# Altium schematic sheet Sheet1.SchDoc
size A; SheetNumber: 1; SheetTotal: 1
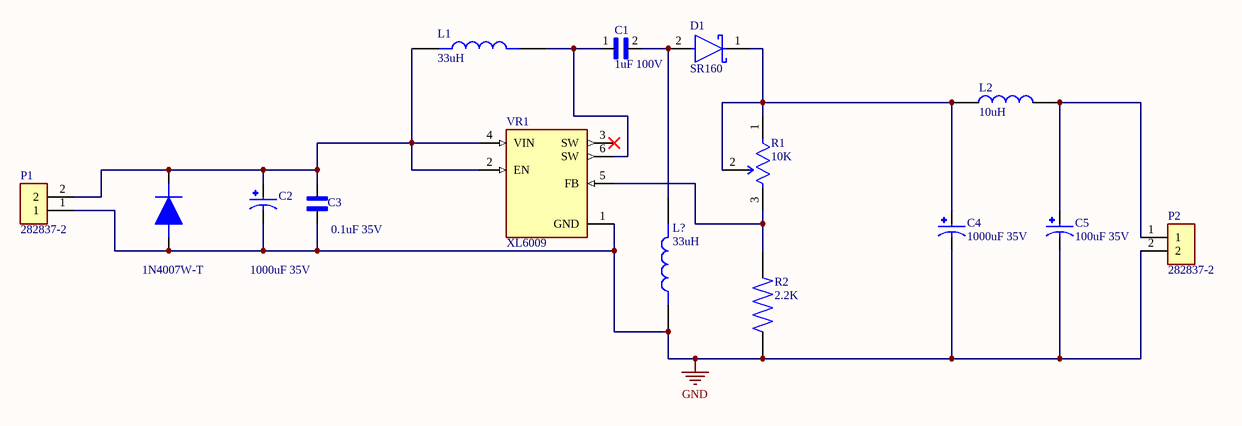
[diagram p0: Sheet1.SchDoc]

## Parts
C1  1uF 100V  [CAPC2012X145N]
C2  1000uF 35V  [CAP_EEVFK1V102V]
C3  0.1uF 35V  [CAPC1608X100N]
C4  1000uF 35V  [CAP_EEVFK1V102V]
C5  100uF 35V  [CAP_EEEFK1V101GL]
D1  SR160  [FP-SOD523-MFG]
L1  33uH  [IND_LQH5BPH330MT0L]
L2  10uH  [INDC1608X95N]
L?  33uH  [IND_LQH5BPH330MT0L]
P1  282837-2  [TE_282837-2]
P2  282837-2  [TE_282837-2]
R1  10K  [FP-TS53YJ-MFG]
R2  2.2K  [RES_ERA8ARW222V]
VR1  XL6009  [DPAK170P1435X465-6N]
  1N4007W-T  [SODFL3818X130N]

## Nets
GND: C2.2 C3.2 C4.2 C5.2 L?.1 P1.1 P2.2 R2.1 VR1.1(GND) .2(A)
NetC1_1: C1.1 L1.2 VR1.6(SW)
NetC1_2: C1.2 D1.2(A) L?.2
NetC2_1: C2.1 C3.1 L1.1 P1.2 VR1.2(EN) VR1.4(VIN) .1(K)
NetC4_1: C4.1 D1.1(C) L2.1 R1.1(a) R1.2(b)
NetC5_1: C5.1 L2.2 P2.1
NetR1_3: R1.3(c) R2.2 VR1.5(FB)

Not connected (* = marked no-connect by the designer): VR1 3(SW)*

## Library data of the parts
C1 = C2012X7S2A105M125AB: 1 ÂµF Â±20% 100V Ceramic Capacitor X7S 0805 (2012 Metric); MF: TDK; Package: 2012 TDK; Purchase-URL: https://pricing.snapeda.com/search/part/C2012X7S2A105M125AB/?ref=eda; Value: *; Availability: In Stock; SnapEDA_Link: https://www.snapeda.com/parts/C2012X7S2A105M125AB/TDK/view-part/?ref=snap; MP: C2012X7S2A105M125AB; Price: None; Check_prices: https://www.snapeda.com/parts/C2012X7S2A105M125AB/TDK/view-part/?ref=eda
C2 C4 = EEVFK1V102V: 1000ÂµF 35V Aluminum Electrolytic Capacitors Radial, Can - SMD 5000 Hrs @ 105Â°C; MP: EEV-FK1V102V; MF: Panasonic; Purchase-URL: https://pricing.snapeda.com/search/part/EEV-FK1V102V/?ref=eda; Price: None; SnapEDA_Link: https://www.snapeda.com/parts/EEV-FK1V102V/Panasonic/view-part/?ref=snap; Check_prices: https://www.snapeda.com/parts/EEV-FK1V102V/Panasonic/view-part/?ref=eda; Package: RADIAL-2 Panasonic; Availability: In Stock; Value: *
C3 = MBJCG168BB7104KTPA18: 0.1uF 35V 10% Multilayer Ceramic Capacitor X7R 0603 (1608 Metric); MF: Taiyo Yuden; SnapEDA_Link: https://www.snapeda.com/parts/MBJCG168BB7104KTPA18/Taiyo+Yuden/view-part/?ref=snap; Package: 1608-2 TAIYO; Value: *; MP: MBJCG168BB7104KTPA18; Check_prices: https://www.snapeda.com/parts/MBJCG168BB7104KTPA18/Taiyo+Yuden/view-part/?ref=eda
C5 = EEEFK1V101GL: CAP ALUM 100UF 20% 35V SMD; MF: Panasonic; SnapEDA_Link: https://www.snapeda.com/parts/EEEFK1V101GL/Panasonic/view-part/?ref=snap; Package: RADIAL-2 Panasonic; Value: *; MP: EEEFK1V101GL; Check_prices: https://www.snapeda.com/parts/EEEFK1V101GL/Panasonic/view-part/?ref=eda
D1 = CMP-12790-000053-1: DIODE SCHOTTKY 30V 200MA SOD523; Manufacturer: Diodes Inc.; Manufacturer Part Number: SDM20U30-7; Automotive Grade: Grade 1; Value: 20pF; Max Surge Forward Current: 1A; Description: Diode Schottky 30V 200mA Surface Mount SOD-523; Max Junction Temp: +125°C; Peak Reverse Current: 150uA; ComponentLink2Description: Datasheet; Automotive: Yes; Octopart: https://octopart.com/sdm20u30-7-diodes+inc.-333874; Device Class L1: Discrete Semiconductors; Footprint Url: https://www.diodes.com/assets/Package-Files/SOD523.pdf; Forward Current: 200mA; Capacitance: 20pF; Device Class L3: Schottky Diodes; Height: 0.65mm; Lead Free: Yes; Mouser Description: SDM20U30 Series 20 V 200 mA Surface Mount Schottky Barrier Diode - SOD-523; Temperature Range Low: -65°C; Digikey Description: DIODE SCHOTTKY 30V 200MA SOD523; Category: Diode; Reverse Voltage: 30V; RoHS: TRUE; Temperature Range High: +125°C; ComponentLink2URL: https://www.diodes.com/assets/Datasheets/ds30397.pdf; Device Class L2: Diodes; Max Repetitive Reverse Voltage: 30V; Temperature: -65°C to +125°C; Package: SOD523
L1 L? = LQH5BPH330MT0L: Inductor Power Chip Shielded Wirewound 4.7uH 30% 100KHz Ferrite 2A 0.0696Ohm DCR 2020 Automotive T/R; Package: None; Price: None; Value: *; MP: LQH5BPH330MT0L; Availability: Unavailable
L2 = LQM18DN100M70L: Inductor with Inductance 10uH Tol.+/-20% Package 0603 (1608); MF: Murata Electronics; SnapEDA_Link: https://www.snapeda.com/parts/LQM18DN100M70L/Murata/view-part/?ref=snap; Package: 0603 Murata; Value: *; MP: LQM18DN100M70L; Check_prices: https://www.snapeda.com/parts/LQM18DN100M70L/Murata/view-part/?ref=eda
P1 P2 = 282837-2: Ð Ð°Ð·ÑŠÐµÐ¼Ð½Ñ‹Ðµ ÐºÐ»ÐµÐ¼Ð¼Ð½Ñ‹Ðµ ÐºÐ¾Ð»Ð¾Ð´ÐºÐ¸ Ð Ð¾Ð·ÐµÑ‚ÐºÐ° 2 Ð¿Ð¾Ð»Ð¾Ð¶ÐµÐ½Ð¸Ñ 5,08 Ð¼Ð¼ ÐŸÑ€Ð¸Ð¿Ð¾Ð¹ Ð¿Ñ€ÑÐ¼Ð¾Ð¹ Ñ‡ÐµÑ€ÐµÐ· Ð¾Ñ‚Ð²ÐµÑ€ÑÑ‚Ð¸Ðµ 13,5 Ð / ÐºÐ¾Ð½Ñ‚Ð°ÐºÑ‚; MF: TE Connectivity; SnapEDA_Link: https://www.snapeda.com/parts/282837-2/TE+Connectivity+AMP+Connectors/view-part/?ref=snap; Price: None; Check_prices: https://www.snapeda.com/parts/282837-2/TE+Connectivity+AMP+Connectors/view-part/?ref=eda; Purchase-URL: https://pricing.snapeda.com/search/part/282837-2/?ref=eda; MP: 282837-2; Value: *; Availability: In Stock; Package: None
R1 = CMP-02410-000009-1: TRIMMER 20K OHM 0.25W J LEAD TOP; Resistance Tolerance: 20%; Number of Turns: 1; Temperature Coefficient: 100ppm/°C; Resistance: 20kR; Power Rating: 250mW; Length: 5mm; Military Standard: Not; Taper: Linear; Series: TS53Y; Mount: Surface Mount; Radiation Hardening: No; RoHS Compliant: Yes; Depth: 5.5mm; Package Quantity: 1; Min Operating Temperature: -55°C; Technology: CERMET; Max Operating Temperature: 125°C; Packaging: Tape and Reel; Termination: SMD/SMT; Tolerance: 20%; Resistor Type: Cermet; Width: 5mm; Max Power Dissipation: 250mW; Height: 0.106inch
R2 = ERA8ARW222V: Package: None; Availability: Unavailable; Value: *; MP: ERA8ARW222V; Price: None
VR1 = XL6009: The XL6009 regulator is a wide input range, current mode, DC/DC converter which is capable of generating either positive or negative output voltages.; MF: XLSEMI; Package: TO-263-5L XLSEMI; Price: None; Value: *; SnapEDA_Link: https://www.snapeda.com/parts/XL6009/XLSEMI/view-part/?ref=snap; MP: XL6009; Availability: Not in stock; Check_prices: https://www.snapeda.com/parts/XL6009/XLSEMI/view-part/?ref=eda
 = 1N4007W-T: Diode Standard 1000 V 1A Surface Mount SOD-123F; MF: Rectron USA; SnapEDA_Link: https://www.snapeda.com/parts/1N4007W/Rectron/view-part/?ref=snap; Package: Package; Value: *; MP: 1N4007W; Check_prices: https://www.snapeda.com/parts/1N4007W/Rectron/view-part/?ref=eda